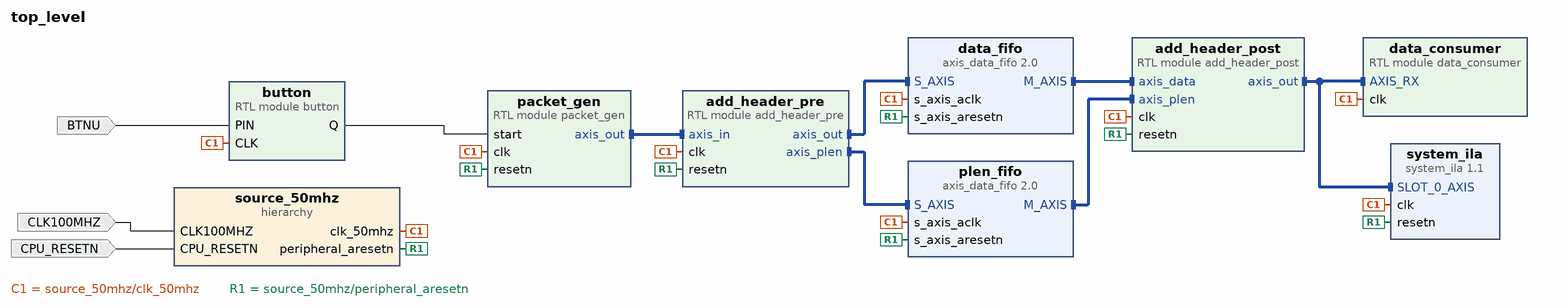
[diagram p0: block diagram of the top level]
# Vivado block design top_level, xc7a100tcsg324-1, Vivado 2021.1
create_bd_design top_level

create_bd_port -dir I -type clk CLK100MHZ
create_bd_port -dir I -type rst CPU_RESETN
create_bd_port -dir I BTNU

create_bd_cell -type hier source_50mhz
create_bd_cell -type module -reference packet_gen packet_gen
create_bd_cell -type module -reference button button
create_bd_cell -type module -reference data_consumer data_consumer
set_property -dict {CONFIG.DW 128} [get_bd_cells data_consumer]
create_bd_cell -type ip -vlnv xilinx.com:ip:system_ila:1.1 system_ila
set_property -dict [list \
  CONFIG.C_MON_TYPE INTERFACE \
  CONFIG.C_NUM_MONITOR_SLOTS 1 \
  CONFIG.C_SLOT 0 \
  CONFIG.C_SLOT_0_INTF_TYPE xilinx.com:interface:axis_rtl:1.0 \
  CONFIG.C_SLOT_1_INTF_TYPE xilinx.com:interface:axis_rtl:1.0 \
  CONFIG.C_SLOT_2_INTF_TYPE xilinx.com:interface:axis_rtl:1.0 \
] [get_bd_cells system_ila]
create_bd_cell -type module -reference add_header_pre add_header_pre
create_bd_cell -type ip -vlnv xilinx.com:ip:axis_data_fifo:2.0 data_fifo
set_property -dict {CONFIG.FIFO_DEPTH 2048} [get_bd_cells data_fifo]
create_bd_cell -type ip -vlnv xilinx.com:ip:axis_data_fifo:2.0 plen_fifo
set_property -dict {CONFIG.FIFO_DEPTH 2048} [get_bd_cells plen_fifo]
create_bd_cell -type module -reference add_header_post add_header_post

# ---- hierarchy /source_50mhz ----
current_bd_instance /source_50mhz
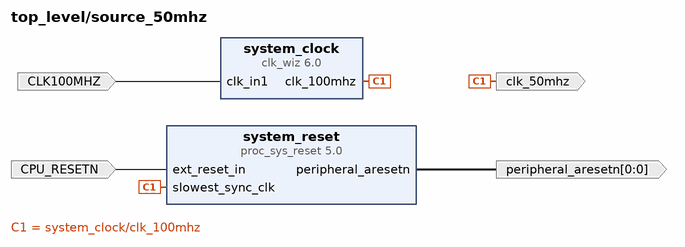
[diagram p1: block diagram inside /source_50mhz]
create_bd_pin -dir I -type clk CLK100MHZ
create_bd_pin -dir I -type rst CPU_RESETN
create_bd_pin -dir O -from 0 -to 0 peripheral_aresetn
create_bd_pin -dir O clk_50mhz

create_bd_cell -type ip -vlnv xilinx.com:ip:clk_wiz:6.0 system_clock
set_property -dict [list \
  CONFIG.CLKOUT1_JITTER 151.636 \
  CONFIG.CLKOUT1_REQUESTED_OUT_FREQ 50 \
  CONFIG.CLK_OUT1_PORT clk_100mhz \
  CONFIG.MMCM_CLKOUT0_DIVIDE_F 20.000 \
  CONFIG.USE_LOCKED false \
  CONFIG.USE_RESET false \
] [get_bd_cells system_clock]
create_bd_cell -type ip -vlnv xilinx.com:ip:proc_sys_reset:5.0 system_reset

# ---- connections ----

current_bd_instance /source_50mhz
connect_bd_net -net clk_in1_0_1 [get_bd_pins CLK100MHZ] [get_bd_pins system_clock/clk_in1]
connect_bd_net -net ext_reset_in_0_1 [get_bd_pins CPU_RESETN] [get_bd_pins system_reset/ext_reset_in]
connect_bd_net -net proc_sys_reset_0_peripheral_aresetn [get_bd_pins system_reset/peripheral_aresetn] [get_bd_pins peripheral_aresetn]
connect_bd_net [get_bd_pins system_clock/clk_100mhz] [get_bd_pins system_reset/slowest_sync_clk] [get_bd_pins clk_50mhz]

current_bd_instance /
connect_bd_intf_net [get_bd_intf_pins data_consumer/AXIS_RX] [get_bd_intf_pins add_header_post/axis_out]
connect_bd_intf_net [get_bd_intf_pins data_consumer/AXIS_RX] [get_bd_intf_pins system_ila/SLOT_0_AXIS]
connect_bd_intf_net [get_bd_intf_pins data_fifo/S_AXIS] [get_bd_intf_pins add_header_pre/axis_out]
connect_bd_intf_net [get_bd_intf_pins plen_fifo/S_AXIS] [get_bd_intf_pins add_header_pre/axis_plen]
connect_bd_intf_net [get_bd_intf_pins add_header_post/axis_data] [get_bd_intf_pins data_fifo/M_AXIS]
connect_bd_intf_net [get_bd_intf_pins packet_gen/axis_out] [get_bd_intf_pins add_header_pre/axis_in]
connect_bd_intf_net [get_bd_intf_pins add_header_post/axis_plen] [get_bd_intf_pins plen_fifo/M_AXIS]
connect_bd_net -net PIN_0_1 [get_bd_ports BTNU] [get_bd_pins button/PIN]
connect_bd_net [get_bd_pins button/Q] [get_bd_pins packet_gen/start]
connect_bd_net -net clk_in1_0_1 [get_bd_ports CLK100MHZ] [get_bd_pins source_50mhz/CLK100MHZ]
connect_bd_net -net ext_reset_in_0_1 [get_bd_ports CPU_RESETN] [get_bd_pins source_50mhz/CPU_RESETN]
connect_bd_net [get_bd_pins source_50mhz/clk_50mhz] \
  [get_bd_pins packet_gen/clk] [get_bd_pins button/CLK] [get_bd_pins data_consumer/clk] [get_bd_pins system_ila/clk] \
  [get_bd_pins add_header_pre/clk] [get_bd_pins data_fifo/s_axis_aclk] [get_bd_pins plen_fifo/s_axis_aclk] \
  [get_bd_pins add_header_post/clk]
connect_bd_net [get_bd_pins source_50mhz/peripheral_aresetn] \
  [get_bd_pins packet_gen/resetn] [get_bd_pins system_ila/resetn] [get_bd_pins add_header_pre/resetn] \
  [get_bd_pins data_fifo/s_axis_aresetn] [get_bd_pins plen_fifo/s_axis_aresetn] [get_bd_pins add_header_post/resetn]

validate_bd_design
save_bd_design
